# EAGLE design DS8_SCHEMATICv0.1 (EAGLE 9.5.2)

## Sheet 1 of 2: Main
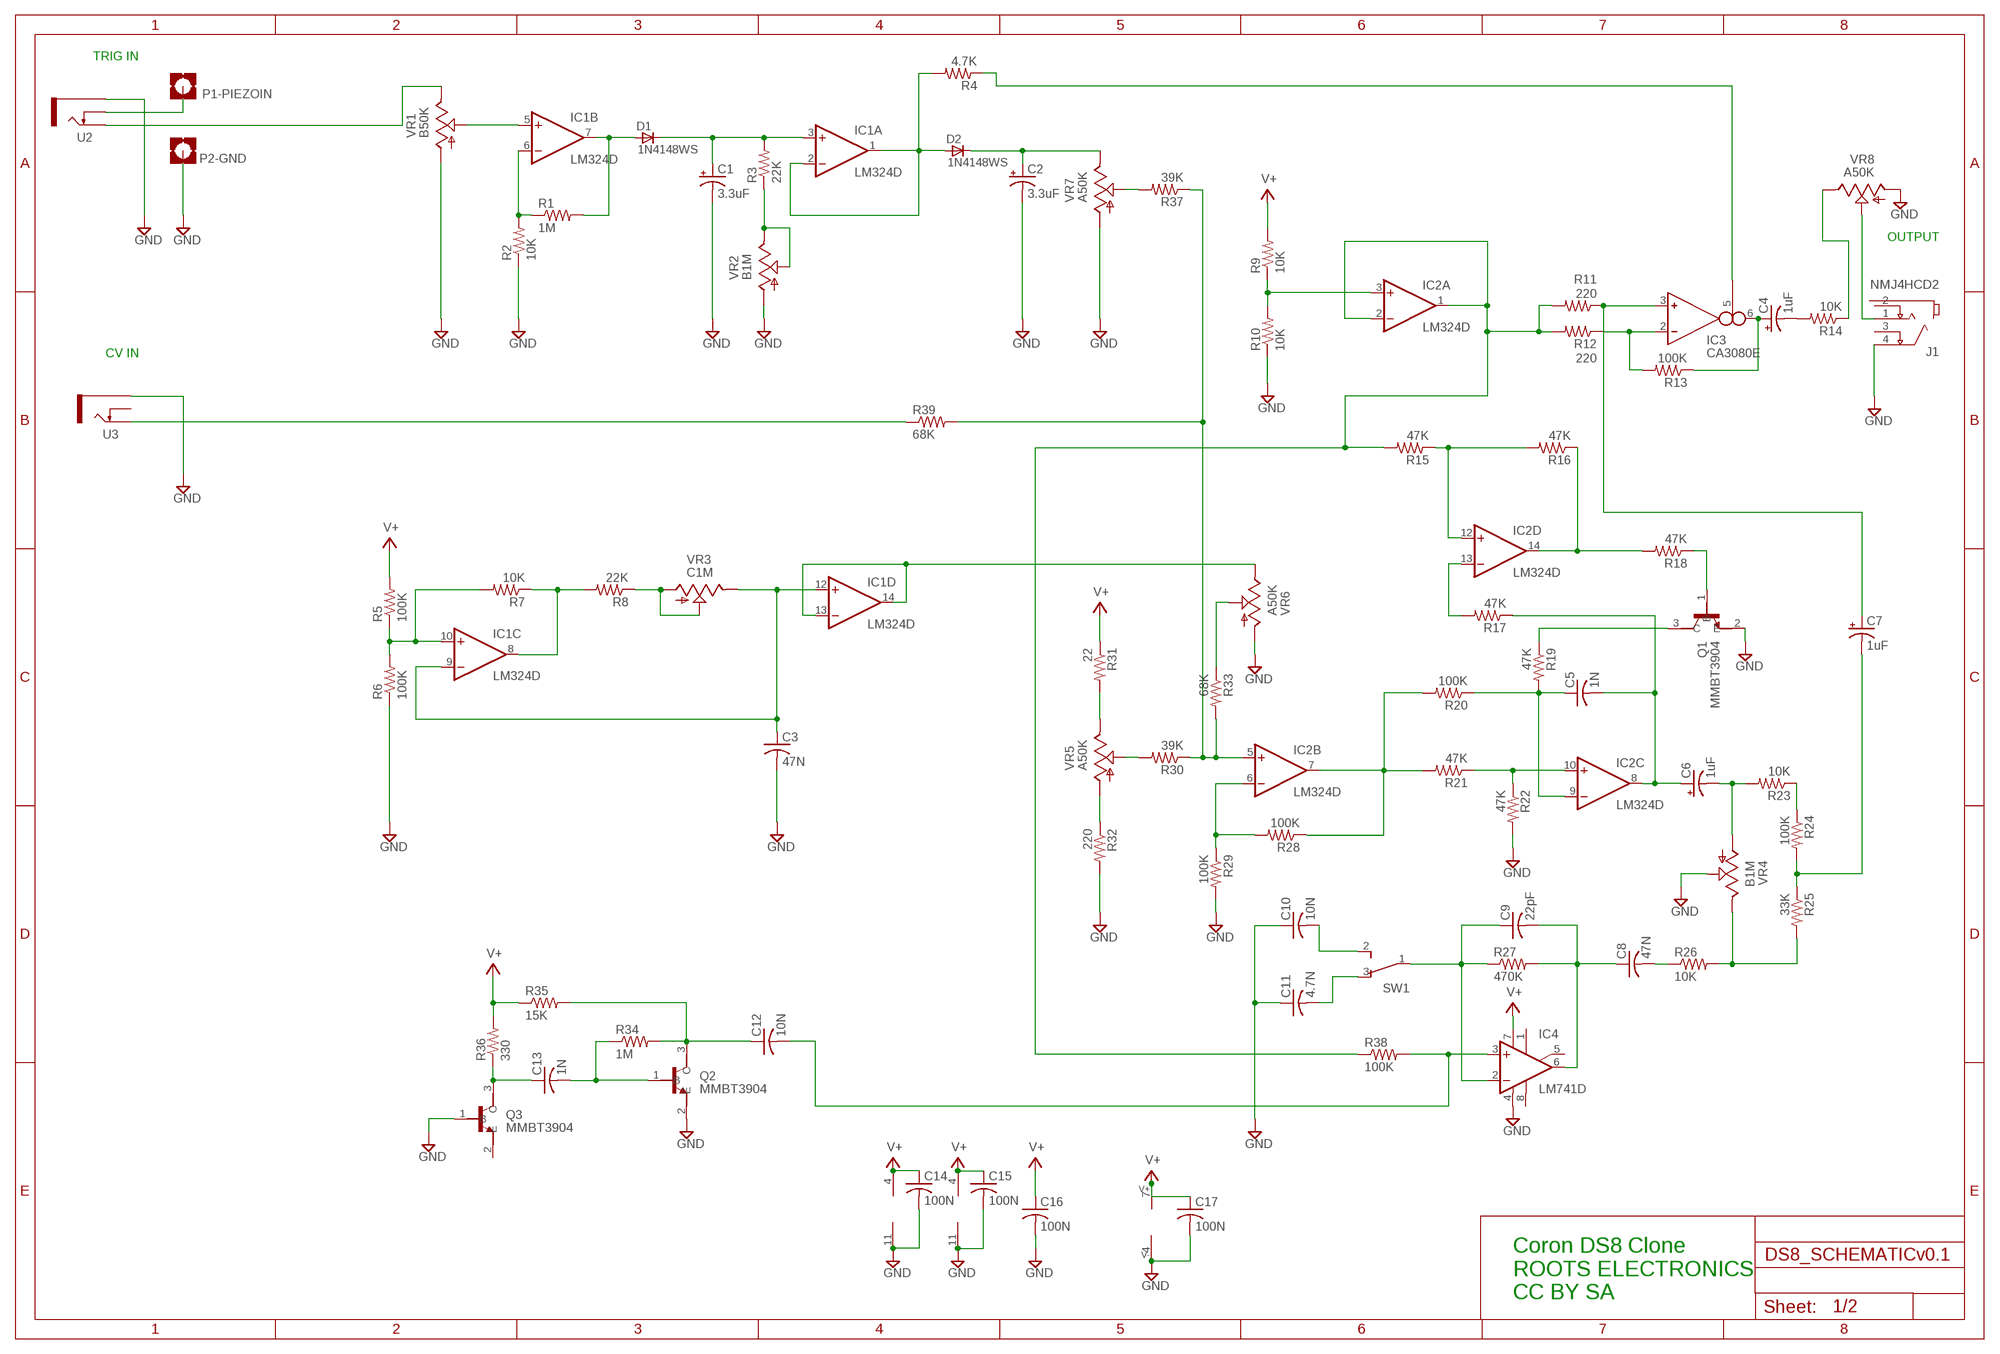
[diagram p0: schematic, sheet 1]

### Parts
C1  3.3uF  CPOL-USC  [PANASONIC_C]
C2  3.3uF  CPOL-USC  [PANASONIC_C]
C3  47N  C-USC0603  [C0603]
C4  1uF  CPOL-USB  [PANASONIC_B]
C5  1N  C-USC0603  [C0603]
C6  1uF  CPOL-USB  [PANASONIC_B]
C7  1uF  CPOL-USB  [PANASONIC_B]
C8  47N  C-USC0603  [C0603]
C9  22pF  C-USC0603  [C0603]
C10  10N  C-USC0603  [C0603]
C11  4.7N  C-USC0603  [C0603]
C12  10N  C-USC0603  [C0603]
C13  1N  C-USC0603  [C0603]
C14  100N  C-USC0603  [C0603]
C15  100N  C-USC0603  [C0603]
C16  100N  C-USC0603  [C0603]
C17  100N  C-USC0603  [C0603]
D1  1N4148WS  [SOD323F]
D2  1N4148WS  [SOD323F]
IC1  LM324D  [SO14]
IC2  LM324D  [SO14]
IC3  CA3080E  [DIL08]
IC4  LM741D  [SO08]
J1  NMJ4HCD2  [NEUTRIK_NMJ4HCD2]
P1-PIEZOIN  MOUNT-PAD-SQUARE2.8  [2,8-PAD-SQUARE]
P2-GND  MOUNT-PAD-SQUARE2.8  [2,8-PAD-SQUARE]
Q1  MMBT3904  [SOT95P240X120-3N]
Q2  MMBT3904  [SOT95P240X120-3N]
Q3  MMBT3904  [SOT95P240X120-3N]
R1  1M  R-US_R0603  [R0603]
R2  10K  R-US_R0603  [R0603]
R3  22K  R-US_R0603  [R0603]
R4  4.7K  R-US_R0603  [R0603]
R5  100K  R-US_R0603  [R0603]
R6  100K  R-US_R0603  [R0603]
R7  10K  R-US_R0603  [R0603]
R8  22K  R-US_R0603  [R0603]
R9  10K  R-US_R0603  [R0603]
R10  10K  R-US_R0603  [R0603]
R11  220  R-US_R0603  [R0603]
R12  220  R-US_R0603  [R0603]
R13  100K  R-US_R0603  [R0603]
R14  10K  R-US_R0603  [R0603]
R15  47K  R-US_R0603  [R0603]
R16  47K  R-US_R0603  [R0603]
R17  47K  R-US_R0603  [R0603]
R18  47K  R-US_R0603  [R0603]
R19  47K  R-US_R0603  [R0603]
R20  100K  R-US_R0603  [R0603]
R21  47K  R-US_R0603  [R0603]
R22  47K  R-US_R0603  [R0603]
R23  10K  R-US_R0603  [R0603]
R24  100K  R-US_R0603  [R0603]
R25  33K  R-US_R0603  [R0603]
R26  10K  R-US_R0603  [R0603]
R27  470K  R-US_R0603  [R0603]
R28  100K  R-US_R0603  [R0603]
R29  100K  R-US_R0603  [R0603]
R30  39K  R-US_R0603  [R0603]
R31  22  R-US_R0603  [R0603]
R32  220  R-US_R0603  [R0603]
R33  68K  R-US_R0603  [R0603]
R34  1M  R-US_R0603  [R0603]
R35  15K  R-US_R0603  [R0603]
R36  330  R-US_R0603  [R0603]
R37  39K  R-US_R0603  [R0603]
R38  100K  R-US_R0603  [R0603]
R39  68K  R-US_R0603  [R0603]
SW1  450301014042  [450301014042]
U2  THONKICONNNEW  [WQP-PJ301M-12_JACK]
U3  THONKICONNNEW  [WQP-PJ301M-12_JACK]
VR1  B50K  9MM_SNAP-IN_POT_  [9MM_SNAP-IN_POT]
VR2  B1M  9MM_SNAP-IN_POT_  [9MM_SNAP-IN_POT]
VR3  C1M  9MM_SNAP-IN_POT_  [9MM_SNAP-IN_POT]
VR4  B1M  9MM_SNAP-IN_POT_  [9MM_SNAP-IN_POT]
VR5  A50K  9MM_SNAP-IN_POT_  [9MM_SNAP-IN_POT]
VR6  A50K  9MM_SNAP-IN_POT_  [9MM_SNAP-IN_POT]
VR7  A50K  9MM_SNAP-IN_POT_  [9MM_SNAP-IN_POT]
VR8  A50K  9MM_SNAP-IN_POT_  [9MM_SNAP-IN_POT]

### Nets
GND: C1.- C2.- C3.2 C10.1 C11.1 C14.2 C15.2 C16.2 C17.2 IC1.11(P:V-) IC2.11(P:V-) IC3.4(V-) IC4.4(V-) J1.4(S) P2-GND.B2,8(MOUNT) Q1.2(E) Q2.2(E) Q3.1(B) R2.1 R6.1 R10.1 R22.2 R29.2 R32.2 U2.P$3_SLEEVE(SLEEVE) U3.P$3_SLEEVE(SLEEVE) VR1.1(A) VR2.1(A) VR4.2(S) VR6.1(A) VR7.1(A) VR8.1(A) ; also sheet 2
N$1: P1-PIEZOIN.B2,8(MOUNT) U2.P$2_SWITCH(SWITCH)
N$2: U2.P$1_TIP(TIP) VR1.3(E)
N$3: IC1.5(B:+IN) VR1.2(S)
N$4: IC1.6(B:-IN) R1.1 R2.2
N$5: D1.A IC1.7(B:OUT) R1.2
N$6: C1.+ D1.C IC1.3(A:+IN) R3.2
N$7: D2.A IC1.1(A:OUT) IC1.2(A:-IN) R4.2
N$8: C2.+ D2.C VR7.3(E)
N$9: R3.1 VR2.2(S) VR2.3(E)
N$10: IC1.10(C:+IN) R5.1 R6.2 R7.2
N$11: IC1.8(C:OUT) R7.1 R8.2
N$12: R8.1 VR3.1(A) VR3.2(S)
N$13: C3.1 IC1.9(C:-IN) IC1.12(D:+IN) VR3.3(E)
N$14: IC1.13(D:-IN) IC1.14(D:OUT) VR6.3(E)
N$15: IC2.3(A:+IN) R9.1 R10.2
N$16: C4.- R14.2
N$17: IC2.1(A:OUT) IC2.2(A:-IN) R11.2 R12.2 R15.2 R38.1
N$18: IC3.2(IN_N) R12.1 R13.2
N$19: C7.+ IC3.3(IN_P) R11.1
N$20: C4.+ IC3.6(OUT) R13.1
N$21: IC3.5(I_BIAS) R4.1
N$22: IC2.12(D:+IN) R15.1 R16.2
N$23: IC2.14(D:OUT) R16.1 R18.2
N$24: IC2.13(D:-IN) R17.2
N$25: Q1.1(B) R18.1
N$26: Q1.3(C) R19.1
N$27: C5.2 C6.+ IC2.8(C:OUT) R17.1
N$28: C5.1 IC2.9(C:-IN) R19.2 R20.1
N$29: C6.- R23.2 VR4.1(A)
N$30: IC2.10(C:+IN) R21.1 R22.1
N$31: IC2.7(B:OUT) R20.2 R21.2 R28.1
N$32: C7.- R24.2 R25.1
N$33: R23.1 R24.1
N$34: R25.2 R26.2 VR4.3(E)
N$35: C8.2 R26.1
N$36: C8.1 C9.2 IC4.6(OUT) R27.2
N$37: C9.1 IC4.2(-IN) R27.1 SW1.1
N$38: C10.2 SW1.2
N$39: C11.2 SW1.3
N$40: R30.2 VR5.2(S)
N$41: IC2.6(B:-IN) R28.2 R29.1
N$42: IC2.5(B:+IN) R30.1 R33.2 R37.1 R39.2
N$43: R32.1 VR5.1(A)
N$44: R31.2 VR5.3(E)
N$45: R33.1 VR6.2(S)
N$46: C12.2 IC4.3(+IN) R38.2
N$47: C12.1 Q2.3(C) R34.2 R35.2
N$48: C13.2 Q2.1(B) R34.1
N$49: C13.1 Q3.3(C) R36.1
N$50: R37.2 VR7.2(S)
N$51: R14.1 VR8.3(E)
N$53: R39.1 U3.P$1_TIP(TIP)
N$55: J1.1(T) VR8.2(S)
V+: C14.1 C15.1 C16.1 C17.1 IC1.4(P:V+) IC2.4(P:V+) IC3.7(V+) IC4.7(V+) R5.2 R9.2 R31.1 R35.1 R36.2 ; also sheet 2
Unconnected: IC4.1(ON1) IC4.5(ON2) IC4.8(OPT) J1.2(TN) J1.3(SN) Q3.2(E) U3.P$2_SWITCH(SWITCH)

### Notes on the sheet
- TRIG IN
- OUTPUT
- CV IN
- Coron DS8 Clone
  ROOTS ELECTRONICS
  CC BY SA

## Sheet 2 of 2: Power Supply
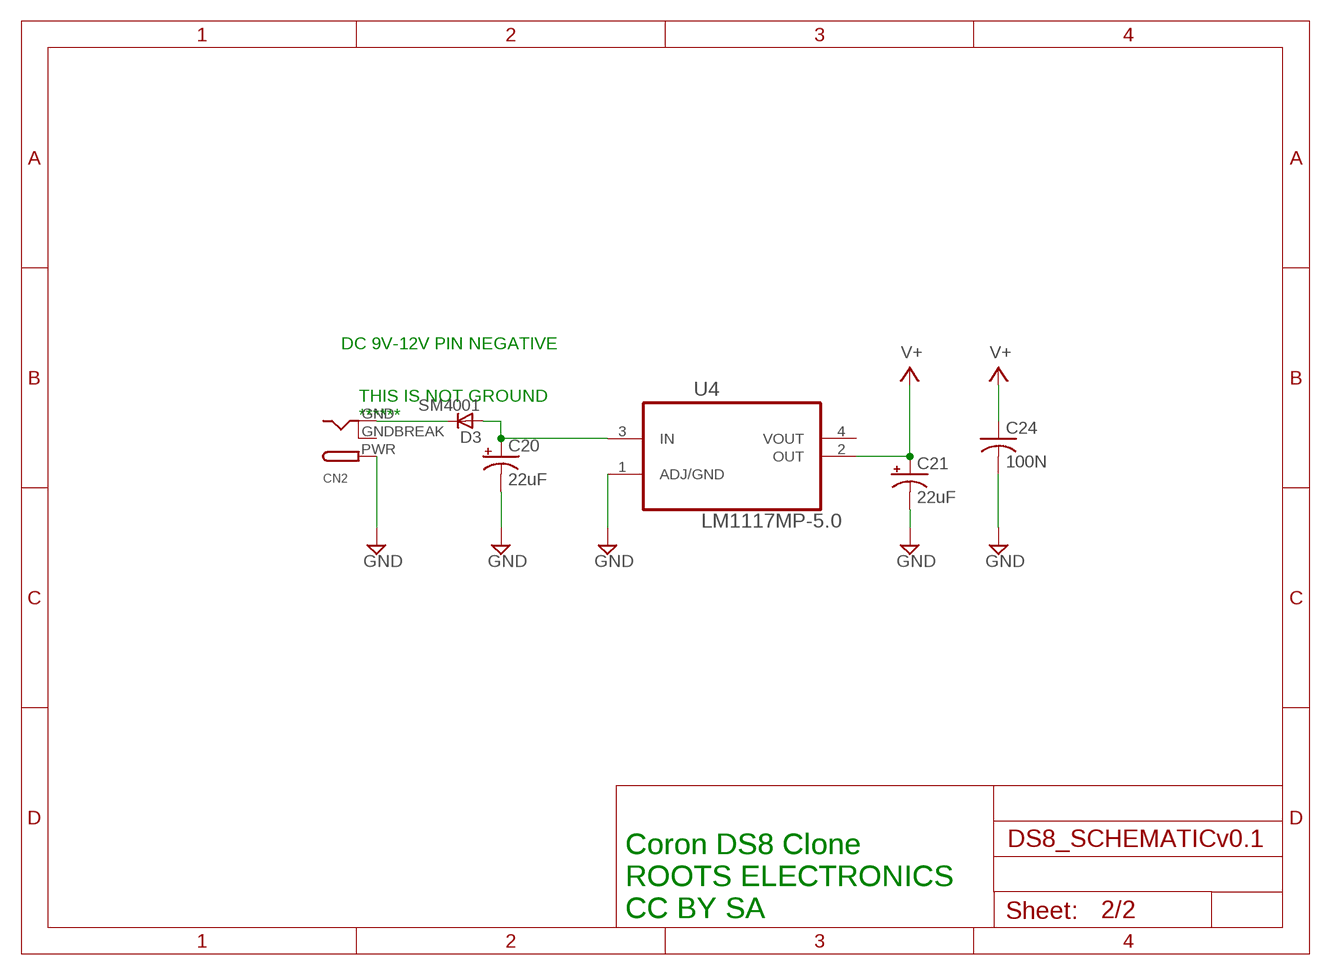
[diagram p1: schematic, sheet 2]

### Parts
C20  22uF  CPOL-USC  [PANASONIC_C]
C21  22uF  CPOL-USC  [PANASONIC_C]
C24  100N  C-USC0603  [C0603]
CN2  DCBARRELPTH  [DCJACK_2MM_PTH]
D3  SM4001  [MELF-MLL41_DO213AB]
U4  LM1117MP-5.0  [SOT230P696X180-4N]

### Nets
GND: C20.- C21.- C24.2 CN2.PWR U4.1(ADJ/GND) ; also sheet 1
N$52: CN2.GND D3.C
N$54: C20.+ D3.A U4.3(IN)
V+: C21.+ C24.1 U4.2(OUT) ; also sheet 1
Unconnected: U4.4(VOUT)

### Notes on the sheet
- DC 9V-12V PIN NEGATIVE
- THIS IS NOT GROUND
  ******
- Coron DS8 Clone
  ROOTS ELECTRONICS
  CC BY SA
- Coron DS8 Clone
  ROOTS ELECTRONICS
  CC BY SA

## Power pins joined to a net without a drawn wire
GNDBREAK: CN2.GNDBREAK

## Library data of the parts
C1 C2 C4 C6 C7 C20 C21 = adafruit:CPOL-US: POLARIZED CAPACITOR, American symbol
C3 C5 C8-C17 C24 = adafruit:C-US: CAPACITOR, American symbol
CN2 = adafruit:DCBARREL: 2.0mm DC Barrel Jack DCJACK_2MM_PTH - Through Hole Jack (4UConnector: 05537)
D1 D2 = _hhn_diodes_smd:1N4148WS: 1N4148 General Purpose Rectifie SMD-Version of 1N4148 Case: SOD 323 F Author: Dipl.-Ing. FH Rainer Bayer HHN Hochschule Heilbronn, rainer.bayer@hs-heilbronn.de Ingenieurbüro ing-rb, mail@ing-rb.de
D3 = _hhn_diodes_smd:SM400*: SM4001 .. SM4007 General Purpose Rectifier, 1 A SMD-Version of 1N4001 .. 1N4007 Case: MELF-MLL41 = DO 213 AB Author: Dipl.-Ing. FH Rainer Bayer HHN Hochschule Heilbronn, rainer.bayer@hs-heilbronn.de Ingenieurbüro ing-rb, mail@ing-rb.de
IC1 IC2 = linear4:LM324: OP AMP
IC3 = ota:CA3080: OTA
IC4 = linear4:*741: OP AMP
J1 = NMJ4HCD2:NMJ4HCD2: Jack 1/4" mono switched - PCBH - supplied with chrome nose nut and NRJ-WB Check prices <https://pricing.snapeda.com/search/part/NMJ4HCD2/?ref=eda>; AVAILABILITY: Warning; DESCRIPTION: Jack 1/4 mono switched - PCBH - supplied with chrome nose nut and NRJ-WB; MF: Neutrik; MP: NMJ4HCD2; PACKAGE: None; PRICE: None; PURCHASE-URL: https://pricing.snapeda.com/search/part/NMJ4HCD2/?ref=eda
P1-PIEZOIN P2-GND = holes:MOUNT-PAD-SQUARE: MOUNTING PAD, square
Q1-Q3 = MMBT3904:MMBT3904: MMBT3904 Series 40 V CE Breakdown 0.2 A NPN General Purpose Amplifier - SOT-23; AVAILABILITY: Unavailable; DESCRIPTION: Bipolar _BJT_ Transistor NPN 40V 200mA 300MHz 300mW Surface Mount SOT-23-3; MF: STMicroelectronics; MP: MMBT3904; PACKAGE: SOT-23-3 Taiwan Semiconductor; PRICE: None
R1-R39 = adafruit:R-US_: RESISTOR, American symbol
SW1 = Wurth_Elektronik_Electromechanic_Switchs_rev15b:450301014042: WS-SHT, 10mm*2.5mm, SPDT, ON-ON, 2.54mm, straight type, THT, Mini Slide Switch, 3 pins
U2 U3 = MusicThingModular:THONKICONN: 3.5mm socket for Eurorack modular synths
U4 = LM1117MP-5.0:LM1117MP-5.0: Linear regulators; AVAILABILITY: Unavailable; DESCRIPTION: Linear Voltage Regulator IC 1 Output 800mA SOT-223; MF: Texas Instruments; MP: LM1117MP-5.0; PACKAGE: SOT-223-4 Texas Instruments; PRICE: None
VR1-VR8 = MusicThingModular:9MM_SNAP-IN_POT: 9mm vertical snap-in pot, Alpha / Panasonic style

## Board
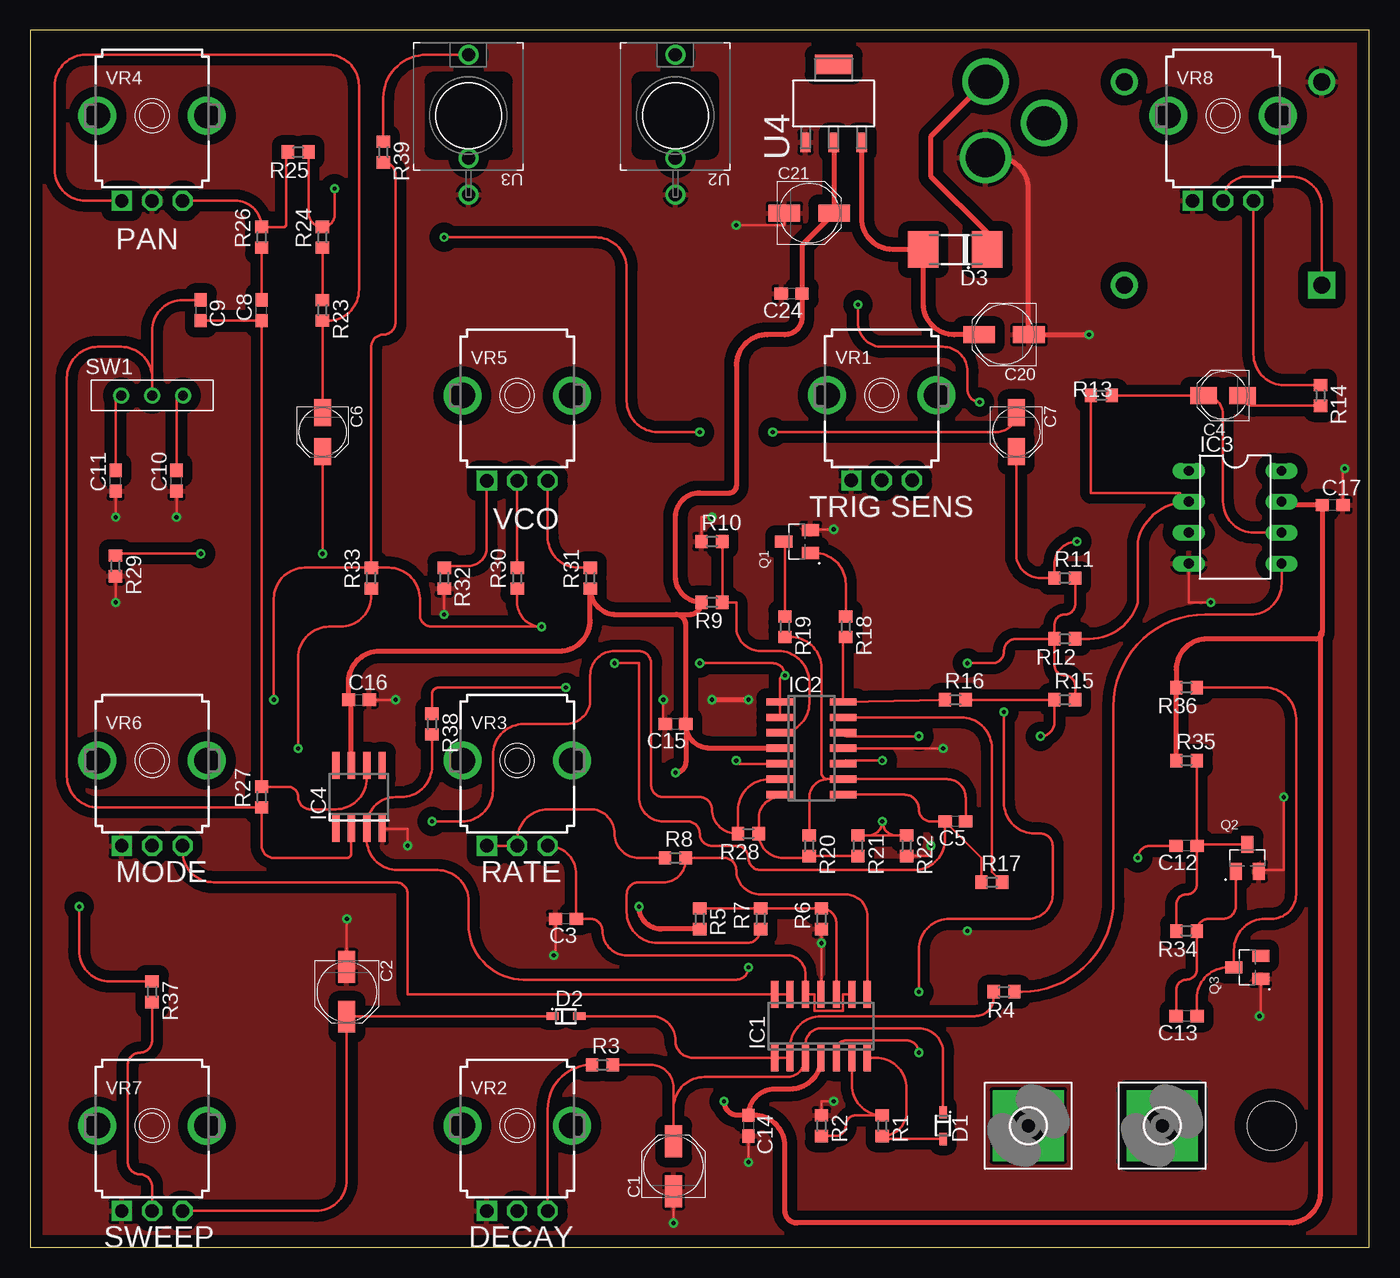
[diagram p2: board, top side]
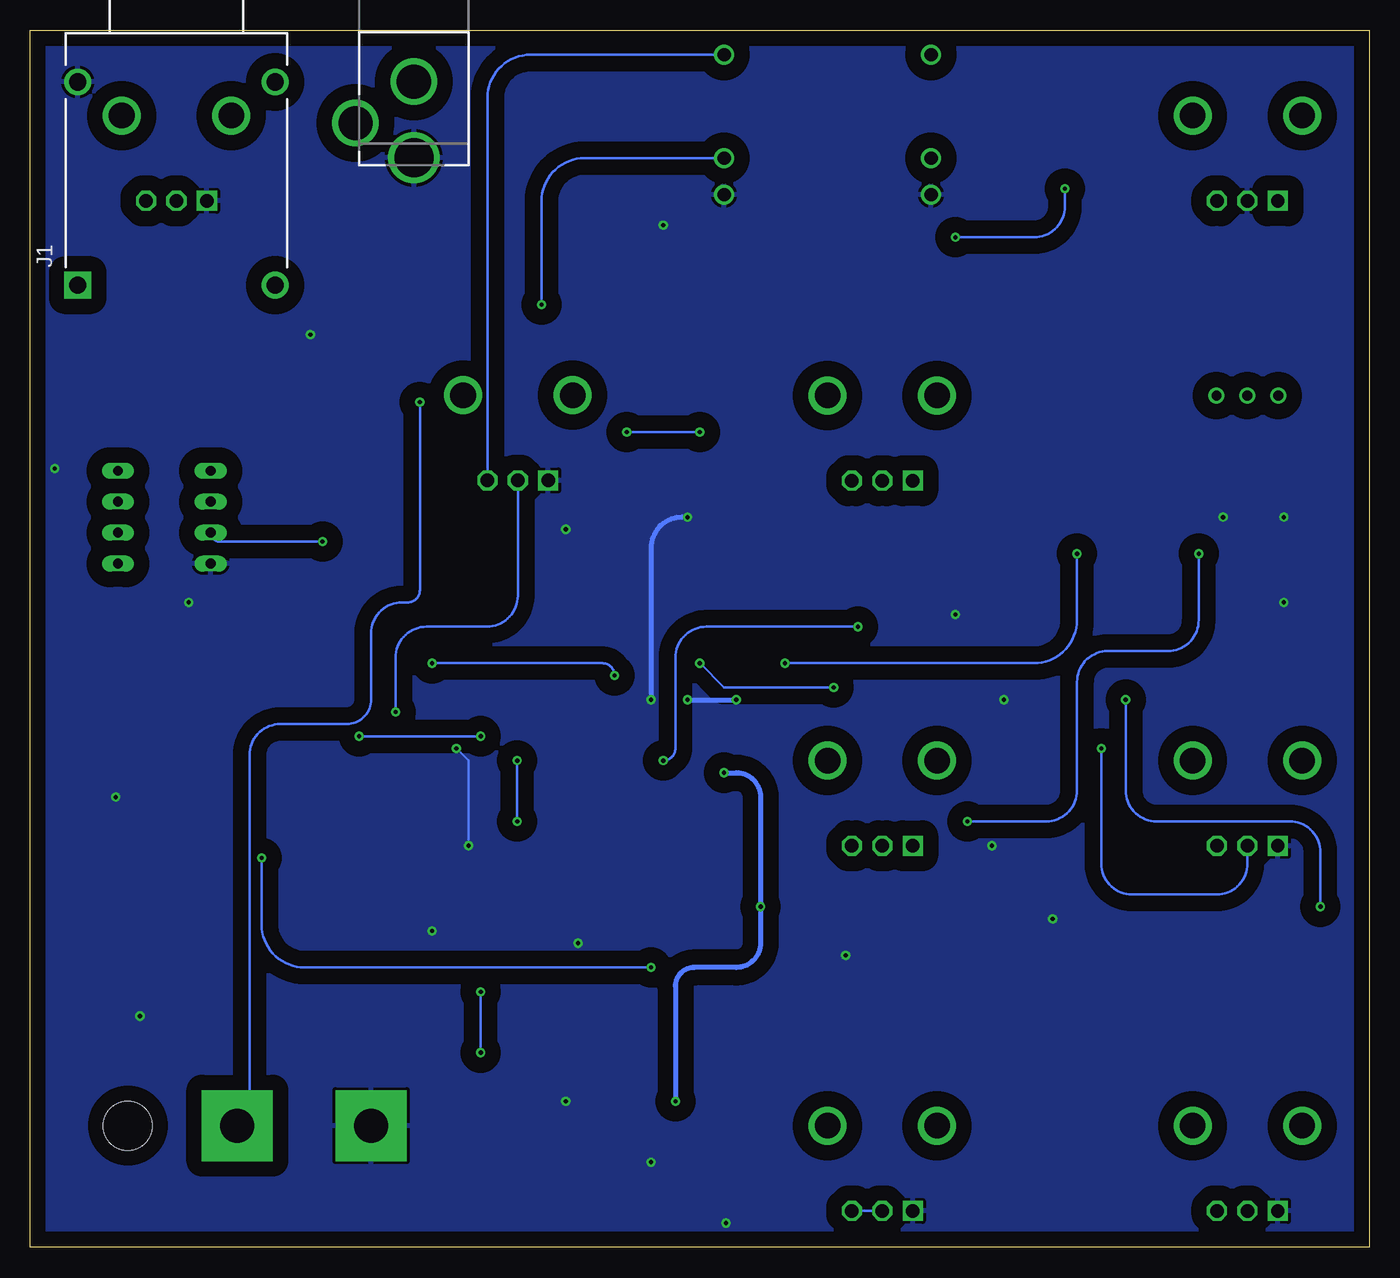
[diagram p3: board, bottom side, seen from below]

Size 110 x 100 mm. Coordinates in mm from the lower left corner, seen from the top.
Outline: 0,0 110,0 110,100 0,100 0,0
Copper layers (1*16): Top 0.035mm / dielectric 1.5mm / Bottom 0.035mm
Design rules "default": minimum track width 6mil, minimum drill 0.35mm, track to track 6mil, track to pad 6mil, pad to pad 6mil, via to via 6mil, smd to smd 6mil, copper to edge 40mil, drill to drill 6mil, minimum pad ring 10mil, minimum via ring 8mil, stop-mask expansion 4mil, vias tented up to drill 0mil, thermal gap 10mil
Holes 4 mm at 102,10

### Footprints (pad centres in the part's own frame; a part is rotated, then mirrored left to right if it is on the bottom)
PANASONIC_C = smd 2.6 x 1.4: + 2.05,0; - -2.05,0
C0603 = smd 1.1 x 1: 1 -0.85,0; 2 0.85,0
PANASONIC_B = smd 2.2 x 1.4: + 1.6,0; - -1.6,0
DCJACK_2MM_PTH = drill 2.8: GND 0,7.35; GNDBREAK 4.8,10.75 | drill 3.2: PWR 0,13.6
SOD323F = smd 1 x 0.6: A 1.1,0; C -1.1,0
MELF-MLL41_DO213AB = smd 2.5 x 3: A 2.625,0; C -2.625,0
SO14 = smd 0.6 x 2.2: 1 -3.81,-2.6; 2 -2.54,-2.6; 3 -1.27,-2.6; 4 0,-2.6; 5 1.27,-2.6; 6 2.54,-2.6; 7 3.81,-2.6; 8 3.81,2.6; 9 2.54,2.6; 10 1.27,2.6; 11 0,2.6; 12 -1.27,2.6; 13 -2.54,2.6; 14 -3.81,2.6
DIL08 = drill 0.813 long: 1 -3.81,-3.81; 2 -1.27,-3.81; 3 1.27,-3.81; 4 3.81,-3.81; 5 3.81,3.81; 6 1.27,3.81; 7 -1.27,3.81; 8 -3.81,3.81
SO08 = smd 0.6 x 2.2: 1 -1.905,-2.6; 2 -0.635,-2.6; 3 0.635,-2.6; 4 1.905,-2.6; 5 1.905,2.6; 6 0.635,2.6; 7 -0.635,2.6; 8 -1.905,2.6
NEUTRIK_NMJ4HCD2 = drill 1.4 pad 2.2 square: 1 -8.935,8.115 | drill 1.4 pad 2.2: 2 -8.935,-8.115; 3 7.765,-8.115; 4 7.765,8.115
2,8-PAD-SQUARE = drill 2.8 pad 5.842 square: B2,8 0,0
SOT95P240X120-3N = smd 1 x 1.4: 1 -0.95,-1.1; 2 0.95,-1.1; 3 0,1.1
R0603 = smd 1 x 1.1: 1 -0.85,0; 2 0.85,0
450301014042 = drill 0.8: 1 0,0; 2 -2.54,0; 3 2.54,0
WQP-PJ301M-12_JACK = drill 1.1: P$1_TIP 0,5; P$2_SWITCH 0,-3.5; P$3_SLEEVE 0,-6.5
SOT230P696X180-4N = smd 1.6 x 0.838: 1 -3.2,2.311; 2 -3.2,0; 3 -3.2,-2.311 | smd 1.6 x 3.099: 4 3.2,0
9MM_SNAP-IN_POT = drill 1.1 square: 1 -2.5,-7 | drill 1.1 octagon: 2 0,-7; 3 2.5,-7 | drill 2.1 pad 2.794: CHASSIS1 -4.5,0; CHASSIS2 4.5,0

### Placement (x,y rotation side)
C1  52.85,6.66 90 top
C2  26,21 270 top
C3  44,27 180 top
C4  98,70 180 top
C5  76,35 180 top
C6  24,67 270 top
C7  81,67 270 top
C8  19,77 90 top
C9  14,77 270 top
C10  12,63 90 top
C11  7,63 90 top
C12  95,33 180 top
C13  95,19 180 top
C14  59,10 270 top
C15  53,43 180 top
C16  27,45 0 top
C17  107,61 0 top
C20  80,75 180 top
C21  64,85 0 top
C24  62.55,78.37 180 top
CN2  78.49,103.14 180 bottom
D1  75,10 270 top
D2  44,19 0 top
D3  76,82 180 top
IC1  64.96,18.18 0 top
IC2  64.18,41.01 270 top
IC3  99,60 270 top
IC4  27,37 0 top
J1  98,88 90 bottom
P1-PIEZOIN  93,10 0 top
P2-GND  82,10 0 top
Q1  63,58 90 top
Q2  100,32 0 top
Q3  100,23 90 top
R1  70,10 270 top
R2  65,10 270 top
R3  47,15 0 top
R4  80,21 180 top
R5  55,27 270 top
R6  65,27 90 top
R7  60,27 90 top
R8  53,32 0 top
R9  56,53 180 top
R10  56,58 0 top
R11  85,55 0 top
R12  85,50 180 top
R13  88,70 180 top
R14  106,70 270 top
R15  85,45 0 top
R16  76,45 0 top
R17  79,30 0 top
R18  67,51 270 top
R19  62,51 270 top
R20  64,33 270 top
R21  68,33 270 top
R22  72,33 270 top
R23  24,77 270 top
R24  24,83 90 top
R25  22,90 180 top
R26  19,83 90 top
R27  19,37 90 top
R28  59,34 180 top
R29  7,56 270 top
R30  40,55 90 top
R31  46,55 90 top
R32  34,55 270 top
R33  28,55 90 top
R34  95,26 180 top
R35  95,40 0 top
R36  95,46 180 top
R37  10,21 270 top
R38  33,43 270 top
R39  29,90 270 top
SW1  10,70 180 top
U2  53,93 0 top
U3  36,93 0 top
U4  66,94 90 top
VR1  69.95,70.02 0 top
VR2  40,10 0 top
VR3  40,40 0 top
VR4  10,93 0 top
VR5  40,70 0 top
VR6  10,40 0 top
VR7  10,10 0 top
VR8  98,93 0 top

### Tracks (layer width: path | path; a pad name or v marks a point on that pad's centre or on a via)
GND  (via drill 0.35)
  Top 0.2: IC2.11 arc90 IC2.11 v75,41 | IC3.4 95.19,53 v97,53 | C17.2 107.85,64 v108,64 | C15.2 52,43 v52,45 | R22.2 74,32.15 v74,33 | C2.- v26,27 | IC4.4 31,34.4 v31,33 | C16.2 v30,45 | R32.2 v34,52 | R29.2 v7,53 | R6.1 v65,25 65,20.78 IC1.11 | R2.1 65,12 v66,12 | C14.2 v59,7 | C1.- v52.85,2 53,2 | C10.1 v12,60 | C11.1 v7,60 | C21.- 61.95,84 v58,84 | Q1.2 64.1,59 v66,59 | R10.1 55.15,60 v56,60 | C3.2 43.15,24 v43,24 | Q3.1 101.1,19 v101,19 | Q2.2 100.95,31 103,31 v103,37
  Top 0.4: CN2.PWR 79.46,89.54 arc-90 82,87 82,75.05 arc90 C20.- v87,75 | v59,45 v56,45
  Bottom 0.2: v74,33 74,40 v75,41
  Bottom 0.4: v56,60 56.46,60 arc-90 59,57.46 v59,45 | v56,45 v52,45
  other vias: 77,26
  pour Bottom (isolate 1.27): 0,0 110,0 110,100 0,100
  pour Top (isolate 0.813): 0,0 110,0 110,100 0,100
N$1  (via drill 0.35)
  Top 0.2: v78,69.46 arc-90 77,70.46 77,72 arc90 75,74 70,74 arc-90 68,76 v68,77.46
  Bottom 0.2: U2.P$2_SWITCH 64.46,89.5 arc-90 68,85.96 v68,77.46 | v78,69.46 78,54 arc90 79,53 79.46,53 arc-90 82,50.46 82,45 arc90 84,43 89.46,43 arc-90 92,40.46 92,11 arc90 P1-PIEZOIN.B2,8
N$2
  Bottom 0.2: U2.P$1_TIP 68.91,98 arc-90 72.45,94.46 VR1.3
N$3  (via drill 0.35)
  Top 0.2: IC1.5 66.23,16.23 arc-90 67,17 72,17 arc-90 v73,16 | v73,21 73,24.46 arc-90 75.54,27 82,27 arc90 84,29 84,33 arc90 83,34 82.54,34 arc-90 80,36.54 v80,44
  Bottom 0.2: v73,16 v73,21 | VR1.2 69.95,53.54 arc90 72.49,51 77.46,51 arc-90 80,48.46 v80,44
N$4
  Top 0.2: IC1.6 67.5,13.35 arc90 R1.1 67.85,10.85 arc90 67,10 arc-90 66.15,9.15 R2.2
N$5
  Top 0.2: IC1.7 69.46,15.58 arc-90 72,13.04 72,11.15 arc-90 R1.2 70,9 arc90 70.1,8.9 D1.A
N$6
  Top 0.2: R3.2 51,15 arc-90 52.85,13.15 C1.+ 52.85,11.46 arc-90 55.39,14 62.11,14 arc90 IC1.3 63.69,16.69 arc-90 65,18 73,18 arc-90 75,16 D1.C
N$7
  Top 0.2: R4.2 79.15,20.54 arc-90 77.61,19 65,19 arc90 62.42,16.42 IC1.2 IC1.1 54.42,15.58 arc-90 53,17 arc90 51,19 D2.A
N$8
  Top 0.2: VR7.3 23.46,3 arc90 26,5.54 C2.+ arc-90 26.05,19 D2.C
N$9
  Top 0.2: VR2.3 42.5,11.35 arc-90 R3.1
  Bottom 0.2: VR2.2 VR2.3
N$10
  Top 0.2: R5.1 R7.2 R6.2 arc-90 66.23,26.62 66.23,21 IC1.10
N$11
  Top 0.2: IC1.8 68.77,27.23 arc90 67,29 60,29 arc-90 58,31 arc90 57,32 R8.2 53.85,31.85 arc-90 52,30 50,30 arc90 49,29 49,27.54 arc90 51.54,25 58.85,25 arc90 R7.1
N$12
  Top 0.2: VR3.1 VR3.2 40,33.46 arc-90 42.54,36 46,36 arc-90 48,34 arc90 50,32 R8.1
N$13
  Top 0.2: VR3.3 arc-90 44.85,30.65 C3.1 46,27 arc-90 47,26 arc90 49,24 62.15,24 arc-90 63.69,22.46 IC1.12 64.41,20.78 64.41,19.43 66.78,19.43 66.78,20.78 IC1.9
N$14
  Top 0.2: IC1.13 IC1.14 31,20.78 31,29 arc90 30,30 15.04,30 arc-90 12.5,32.54 VR6.3
N$15
  Top 0.2: IC2.3 arc90 64,44.7 64,46.46 arc90 61.46,49 60,49 arc-90 58,51 58,53 R9.1 R10.2
N$16
  Top 0.2: R14.2 100.45,69.15 arc-90 C4.-
N$17  (via drill 0.35)
  Top 0.2: R15.2 85.85,46.15 arc90 85,47 arc-90 84.15,47.85 R12.2 | R12.2 84.15,51.15 arc-90 85,52 arc90 85.85,52.85 R11.2 | IC2.2 IC2.1 61.58,46.58 arc-90 v62,47 arc90 61,48 v55,48 | v77,48 79,48 arc90 80,49 arc-90 81,50 R12.2 | R38.1 33,45.46 arc-90 33.54,46 v44,46
  Bottom 0.2: v62,47 arc-90 63,48 v77,48 | v55,48 53,46 v44,46
N$18
  Top 0.2: R12.1 87,50 arc74 91,53 91,58 arc-64 94,61.11 95.03,61.11 arc90 IC3.2 94.46,62 87.15,62 R13.2
N$19  (via drill 0.35)
  Top 0.2: C7.+ 81,57 arc90 83,55 R11.1 84.15,56.15 arc-90 v86,58
  Bottom 0.2: IC3.3 arc-90 94.46,58 v86,58
N$20
  Top 0.2: R13.1 C4.+ arc-90 98,68.4 98,61.27 arc90 100.54,58.73 IC3.6
N$21
  Top 0.2: IC3.5 102.81,54.54 arc-90 100.27,52 96.54,52 arc90 89,44.46 89,28.54 arc-90 81.46,21 R4.1
N$22  (via drill 0.35)
  Top 0.2: R16.2 R15.1 84.15,43.15 arc-90 v83,42 | v73,42 67.06,42 arc-90 IC2.12
  Bottom 0.2: v83,42 v73,42
N$23
  Top 0.2: R16.1 IC2.14 66.78,49.93 arc-90 R18.2
N$24
  Top 0.2: R17.2 79,30.85 79,41.01 arc90 76.46,43.55 IC2.13
N$25
  Top 0.2: R18.1 67,54.51 arc90 64.46,57.05 Q1.1
N$26
  Top 0.2: R19.1 62,57.9 arc90 Q1.3
N$27  (via drill 0.35)
  Top 0.2: C5.2 74,35 arc-90 73,36 arc90 71.8,37.2 IC2.8 | C5.2 78.15,32 R17.1 | C5.2 75.15,33.54 arc-90 72.61,31 60,31 arc-90 59,32 arc90 58,33 56,33 arc-90 55,34 arc90 54,35 52,35 arc-90 50,37 50,48 v48,48 | v24,57 C6.+
  Bottom 0.2: v48,48 27.54,48 arc-90 24,51.54 v24,57
N$28
  Top 0.2: C5.1 76.85,36.93 arc90 75.31,38.47 IC2.9 65.53,38.47 | R19.2 62.46,50.15 arc-90 65,47.61 65,39 arc90 65.53,38.47 | R20.1 64,36.94 arc-90 65.53,38.47
N$29
  Top 0.2: C6.- R23.2 24.46,76.15 arc90 27,78.69 27,86 27,87 27,95.46 arc90 24.46,98 4.54,98 arc90 2,95.46 2,88.54 arc90 4.54,86 VR4.1
N$30  (via drill 0.35)
  Top 0.2: v70,40 67.04,40 arc90 IC2.10 | R21.1 R22.1 71.15,33.85 arc-90 v70,35 arc-90 68.85,33.85 R21.1
  Bottom 0.2: v70,35 v70,40
N$31
  Top 0.2: IC2.7 61.58,37 arc90 59.85,35.27 R28.1 arc90 61.85,32 63.85,32 arc90 R20.2 R21.2
N$32  (via drill 0.35)
  Top 0.2: R25.1 22.85,85 arc90 R24.2 arc90 25,84.85 v25,87 | C7.- arc-90 79.4,67 v61,67 | v55,67 51.54,67 arc-90 49,69.54 49,80.46 arc90 46.46,83 v34,83
  Bottom 0.2: v61,67 v55,67 | v34,83 27.54,83 arc-90 25,85.54 v25,87
N$33
  Top 0.2: R23.1 R24.1
N$34
  Top 0.2: R25.2 arc90 21,89.85 21,84 arc-90 20.85,83.85 R26.2 arc90 16.85,86 VR4.3
N$35
  Top 0.2: C8.2 R26.1
N$36
  Top 0.2: IC4.6 27.64,38.54 arc-90 25.09,36 23,36 arc-90 22,37 arc90 21.15,37.85 R27.2 C8.1 C9.2
N$37
  Top 0.2: IC4.2 26.36,32.37 arc-90 26,32 20,32 arc-90 19,33 R27.1 5.54,36.15 arc-90 3,38.69 3,71.46 arc-90 5.54,74 7.46,74 arc-90 10,71.46 SW1.1 10,75.31 arc-90 12.54,77.85 C9.1
N$38
  Top 0.2: C10.2 12,69.46 arc-90 SW1.2
N$39
  Top 0.2: C11.2 7,69.54 arc-90 SW1.3
N$40
  Top 0.2: R30.2 VR5.2
N$41  (via drill 0.35)
  Top 0.2: IC2.6 60.69,38.47 arc90 58.15,35.93 R28.2 58,34 arc-90 56,36 arc90 55,37 52,37 arc-90 51,38 51,48 arc90 50,49 48,49 arc90 46,47 46,45 arc-90 44,43 40.54,43 arc90 38,40.46 38,37.54 arc-90 35.46,35 v33,35 | v14,57 7.15,57 arc90 R29.1
  Bottom 0.2: v33,35 26.54,35 arc-90 24,37.54 24,46.46 arc90 21.46,49 16.54,49 arc-90 14,51.54 v14,57
N$42  (via drill 0.35)
  Top 0.2: IC2.5 58.26,39.74 arc-90 v58,40 | R30.1 40,53 arc90 v42,51 33,51 arc-90 32,52 32,53.31 arc90 29.46,55.85 R33.2 | R33.2 28,74 arc-90 29,75 arc90 30,76 30,88.15 arc90 R39.2 | R33.2 22.54,55.85 arc90 20,53.31 v20,45 | v4,28 4,24.39 arc90 6.54,21.85 R37.1
  Bottom 0.2: v58,40 arc-90 57,41 57,48.46 arc90 54.46,51 v42,51 | v20,45 20,37.54 arc-90 17.46,35 6.54,35 arc90 4,32.46 v4,28
N$43
  Top 0.2: R32.1 arc-90 34.15,56 36,56 arc90 37.5,57.5 VR5.1
N$44
  Top 0.2: R31.2 45.04,55.85 arc-90 42.5,58.39 VR5.3
N$45  (via drill 0.35)
  Top 0.2: R33.1 28,53.54 arc-90 25.46,51 24.54,51 arc90 22,48.46 v22,41
  Bottom 0.2: v22,41 22,31.54 arc-90 19.46,29 12.54,29 arc-90 10,31.54 VR6.2
N$46  (via drill 0.35)
  Top 0.2: R38.2 33,39.54 arc-90 30.46,37 30,37 arc90 27.64,34.63 IC4.3 27.64,33.54 arc90 30.18,31 33.46,31 arc-90 36,28.46 36,26.54 arc90 40.54,22 58,22 arc90 v59,23 | v91,32 arc-90 92,33 C12.2
  Bottom 0.2: v91,32 91,26.54 arc-90 87.46,23 v59,23
N$47
  Top 0.2: R34.2 94.15,28.15 arc-90 95,29 arc90 95.85,29.85 C12.1 | C12.1 R35.2 | C12.1 arc-90 95.95,33.1 Q2.3
N$48
  Top 0.2: Q2.1 99.05,28.05 arc-90 98,27 96.85,27 arc90 R34.1 95.85,22.85 arc-90 95,22 arc90 94.15,21.15 C13.2
N$49
  Top 0.2: C13.1 95.85,20.46 arc-90 98.39,23 Q3.3 98.9,24.46 arc-90 101.44,27 102,27 arc90 104,29 104,43.46 arc90 101.46,46 R36.1
N$50
  Top 0.2: R37.2 10,17 arc-90 9,16 arc90 8,15 8,7 arc90 9,6 arc-90 10,5 VR7.2
N$51
  Top 0.2: R14.1 103.04,70.85 arc-90 100.5,73.39 VR8.3
N$52
  Top 0.4: D3.C 78.62,83.38 74,88 74,91.3 CN2.GND
N$53
  Top 0.2: R39.1 29,94.46 arc-90 32.54,98 U3.P$1_TIP
N$54
  Top 0.4: C20.+ 75.92,75 arc-90 73.38,77.54 D3.A 70.85,82 arc-90 68.31,84.54 U4.3
N$55
  Top 0.2: VR8.2 arc-90 100,88 103.58,88 arc-90 106.11,85.46 J1.1
V+  (via drill 0.35)
  Top 0.2: U4.2 arc-90 66.03,90.78 66.03,84.97 | 66.03,84.97 arc90 C21.+ arc-90 66.03,84.97
  Top 0.4: U4.2 66.05,90.75 C21.+ 66.03,84.97 63.4,82.35 C24.1 63.4,76.4 arc-90 62,75 60.54,75 arc90 58,72.46 58,62.54 arc-90 57.46,62 55,62 arc90 53,60 53,55.15 arc90 R9.2 arc-90 54.15,52 53,52 | IC4.7 26.36,44.78 arc90 C16.1 26.15,46.46 arc-90 28.69,49 43.46,49 arc90 46,51.54 R31.1 arc90 48.15,52 53,52 | IC2.4 55.84,41.01 arc-90 C15.1 | IC3.7 arc90 103.08,61 C17.1 106.15,50.54 | IC1.4 64.96,15.54 arc-90 62.42,13 61.15,13 arc90 C14.1 | 106.15,50.54 arc-90 105.61,50 96.69,50 arc90 94.15,47.46 R36.2 R35.1 | 106.15,50.54 arc90 106,50.39 106,4.54 arc-90 103.46,2 63,2 arc-90 62,3 62,8.31 arc90 59.46,10.85 C14.1 | C15.1 53.85,39.85 arc-90 v53,39 | R5.2 51.85,26.15 arc-90 v50,28 | C14.1 58.15,10.85 arc-90 v57,12 | C15.1 53.85,51.15 arc90 53,52
  Bottom 0.4: v53,39 52,39 arc90 50,37 v50,28 50,25 arc90 52,23 55.46,23 arc-90 57,21.46 v57,12

### Text on the board
tNames: PAN | TRIG SENS | VCO | MODE | RATE | SWEEP | DECAY